# Altium schematic sheet [12]-MCU_INPUTS.SchDoc
size A4
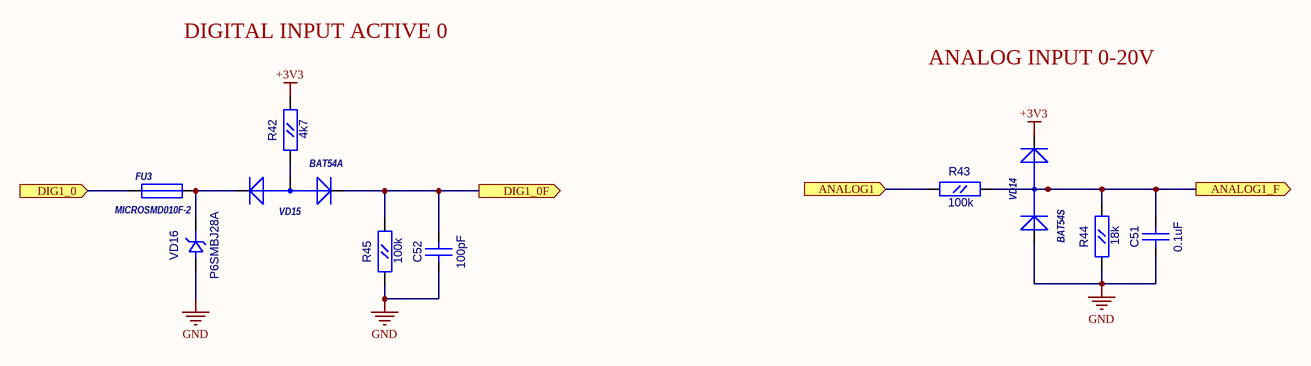
[diagram p0: [12]-MCU_INPUTS.SchDoc]

## Parts
C51  0.1uF  [CC0603]
C52  100pF  [CC0603]
FU3  MICROSMD010F-2  [RC1210]
R42  4k7  [RC0603]
R43  100k  [RC0603]
R44  18k  [RC0603]
R45  100k  [RC0603]
VD14  BAT54S  [SOT-23(GSD)]
VD15  BAT54A  [SOT-23(123)]
VD16  P6SMBJ28A  [SMB]

## Ports
ANALOG1 (in), ANALOG1_F (out), DIG1_0 (in), DIG1_0F (out)

## Nets
+3V3: R42.2(B) VD14.2(K)
GND: C51.1(A) C52.1(A) R44.1(A) R45.1(A) VD14.1(A) VD16.1(A)
ANALOG1: R43.1(A) ; port ANALOG1
ANALOG1_F: C51.2(B) R43.2(B) R44.2(B) VD14.3(AK) ; port ANALOG1_F
DIG1_0: FU3.1 ; port DIG1_0
DIG1_0F: C52.2(B) R45.2(B) VD15.1(K) ; port DIG1_0F
NetFU3_2: FU3.2 VD15.2(K) VD16.2(K)
NetR42_1: R42.1(A) VD15.3(A)

## Notes on the sheet
- DIGITAL INPUT ACTIVE 0
- ANALOG INPUT 0-20V

## Library data of the parts
C51 C52 = CC0603
  C51: Value: 0.1uF
  C52: Value: 100pF
FU3 = MICROSMD: Value: MICROSMD010F-2
R42-R45 = RC0603
  R42: Value: 4k7
  R43 R45: Value: 100k
  R44: Value: 18k
VD14 = BAT54S: 1.0 Ampere General Purpose Rectifier; ComponentField6: Published 8-Jun-2000, Modified 11-July-2000: SIM Model Added.; Value: *
VD15 = BAT54A: 1.0 Ampere General Purpose Rectifier; ComponentField6: Published 8-Jun-2000, Modified 11-July-2000: SIM Model Added.; Value: *
VD16 = SMBJ: Value: P6SMBJ28A